# EAGLE design Board Jadwal v2 (EAGLE 6.6.0)
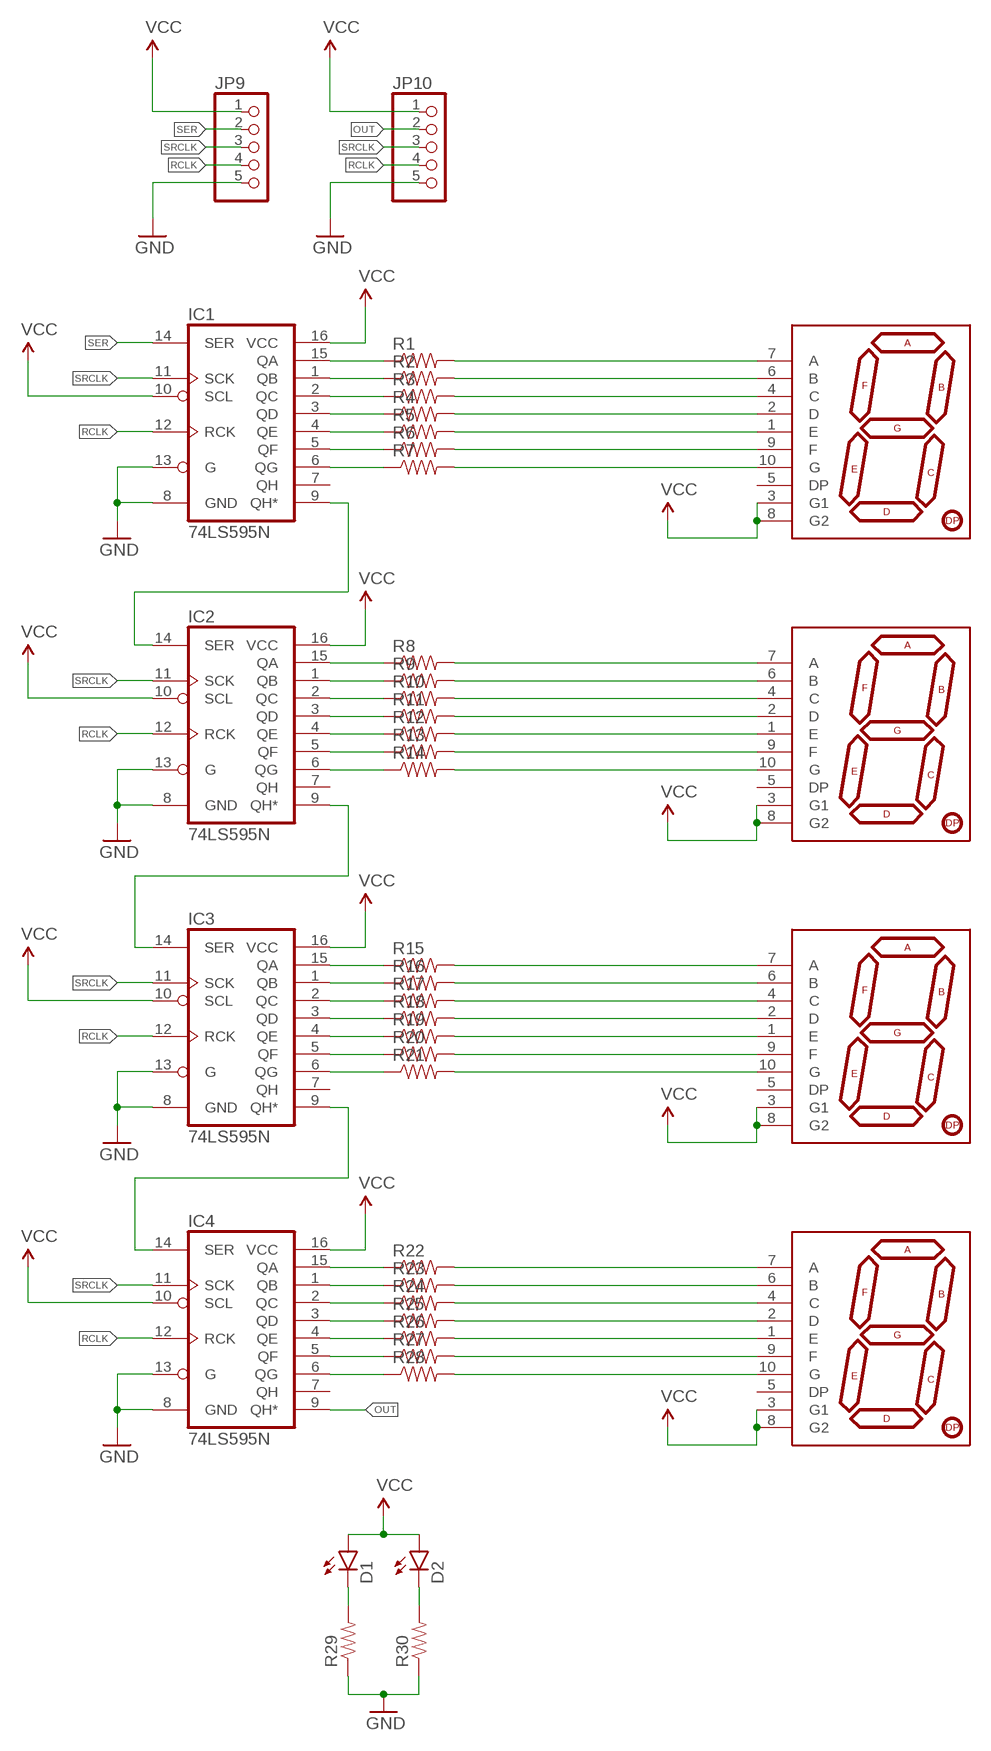
[diagram p0: schematic, sheet 1]

## Parts
D1  LED3MM  [LED3MM]
D2  LED3MM  [LED3MM]
IC1  74LS595N  [DIL16]
IC2  74LS595N  [DIL16]
IC3  74LS595N  [DIL16]
IC4  74LS595N  [DIL16]
JP9  PINHD-1X5  [1X05]
JP10  PINHD-1X5  [1X05]
R1  RESISTORPTH-1/4W  [AXIAL-0.4]
R2  RESISTORPTH-1/4W  [AXIAL-0.4]
R3  RESISTORPTH-1/4W  [AXIAL-0.4]
R4  RESISTORPTH-1/4W  [AXIAL-0.4]
R5  RESISTORPTH-1/4W  [AXIAL-0.4]
R6  RESISTORPTH-1/4W  [AXIAL-0.4]
R7  RESISTORPTH-1/4W  [AXIAL-0.4]
R8  RESISTORPTH-1/4W  [AXIAL-0.4]
R9  RESISTORPTH-1/4W  [AXIAL-0.4]
R10  RESISTORPTH-1/4W  [AXIAL-0.4]
R11  RESISTORPTH-1/4W  [AXIAL-0.4]
R12  RESISTORPTH-1/4W  [AXIAL-0.4]
R13  RESISTORPTH-1/4W  [AXIAL-0.4]
R14  RESISTORPTH-1/4W  [AXIAL-0.4]
R15  RESISTORPTH-1/4W  [AXIAL-0.4]
R16  RESISTORPTH-1/4W  [AXIAL-0.4]
R17  RESISTORPTH-1/4W  [AXIAL-0.4]
R18  RESISTORPTH-1/4W  [AXIAL-0.4]
R19  RESISTORPTH-1/4W  [AXIAL-0.4]
R20  RESISTORPTH-1/4W  [AXIAL-0.4]
R21  RESISTORPTH-1/4W  [AXIAL-0.4]
R22  RESISTORPTH-1/4W  [AXIAL-0.4]
R23  RESISTORPTH-1/4W  [AXIAL-0.4]
R24  RESISTORPTH-1/4W  [AXIAL-0.4]
R25  RESISTORPTH-1/4W  [AXIAL-0.4]
R26  RESISTORPTH-1/4W  [AXIAL-0.4]
R27  RESISTORPTH-1/4W  [AXIAL-0.4]
R28  RESISTORPTH-1/4W  [AXIAL-0.4]
R29  RESISTORPTH-1/4W  [AXIAL-0.4]
R30  RESISTORPTH-1/4W  [AXIAL-0.4]
U$1  7-SEGMENT-DISPLAY-1"-REDEZ  [7-SEGMENT-1"PTH-EZ]
U$2  7-SEGMENT-DISPLAY-1"-REDEZ  [7-SEGMENT-1"PTH-EZ]
U$3  7-SEGMENT-DISPLAY-1"-REDEZ  [7-SEGMENT-1"PTH-EZ]
U$4  7-SEGMENT-DISPLAY-1"-REDEZ  [7-SEGMENT-1"PTH-EZ]

## Nets
A_0: R1.P$2 U$1.7(A)
B_0: R2.P$2 U$1.6(B)
C_0: R3.P$2 U$1.4(C)
D_0: R4.P$2 U$1.2(D)
E_0: R5.P$2 U$1.1(E)
F_0: R6.P$2 U$1.9(F)
G_0: R7.P$2 U$1.10(G)
GND: IC1.8(GND) IC1.13(G) IC2.8(GND) IC2.13(G) IC3.8(GND) IC3.13(G) IC4.8(GND) IC4.13(G) JP9.5 JP10.5 R29.P$1 R30.P$1
N$1: IC1.15(QA) R1.P$1
N$2: IC2.15(QA) R8.P$1
N$3: IC1.1(QB) R2.P$1
N$4: IC1.2(QC) R3.P$1
N$5: IC1.3(QD) R4.P$1
N$6: IC1.4(QE) R5.P$1
N$7: IC1.5(QF) R6.P$1
N$8: IC1.6(QG) R7.P$1
N$9: IC2.1(QB) R9.P$1
N$10: IC2.2(QC) R10.P$1
N$11: IC2.3(QD) R11.P$1
N$12: IC2.4(QE) R12.P$1
N$13: IC2.5(QF) R13.P$1
N$14: IC2.6(QG) R14.P$1
N$15: IC3.15(QA) R15.P$1
N$16: IC3.1(QB) R16.P$1
N$17: IC3.2(QC) R17.P$1
N$18: IC3.3(QD) R18.P$1
N$19: IC3.4(QE) R19.P$1
N$20: IC3.5(QF) R20.P$1
N$21: IC3.6(QG) R21.P$1
N$22: IC4.15(QA) R22.P$1
N$23: IC4.1(QB) R23.P$1
N$24: IC4.2(QC) R24.P$1
N$25: IC4.3(QD) R25.P$1
N$26: IC4.4(QE) R26.P$1
N$27: IC4.5(QF) R27.P$1
N$28: IC4.6(QG) R28.P$1
N$29: IC1.9(QH*) IC2.14(SER)
N$30: IC2.9(QH*) IC3.14(SER)
N$31: IC3.9(QH*) IC4.14(SER)
N$32: D1.K(C) R29.P$2
N$33: D2.K(C) R30.P$2
N$34: R8.P$2 U$2.7(A)
N$35: R9.P$2 U$2.6(B)
N$36: R10.P$2 U$2.4(C)
N$37: R11.P$2 U$2.2(D)
N$38: R12.P$2 U$2.1(E)
N$39: R13.P$2 U$2.9(F)
N$40: R14.P$2 U$2.10(G)
N$41: R15.P$2 U$3.7(A)
N$42: R16.P$2 U$3.6(B)
N$43: R17.P$2 U$3.4(C)
N$44: R18.P$2 U$3.2(D)
N$45: R19.P$2 U$3.1(E)
N$46: R20.P$2 U$3.9(F)
N$47: R21.P$2 U$3.10(G)
N$48: R22.P$2 U$4.7(A)
N$49: R23.P$2 U$4.6(B)
N$50: R24.P$2 U$4.4(C)
N$51: R25.P$2 U$4.2(D)
N$52: R26.P$2 U$4.1(E)
N$53: R27.P$2 U$4.9(F)
N$54: R28.P$2 U$4.10(G)
OUT: IC4.9(QH*) JP10.2
RCLK: IC1.12(RCK) IC2.12(RCK) IC3.12(RCK) IC4.12(RCK) JP9.4 JP10.4
SER: IC1.14(SER) JP9.2
SRCLK: IC1.11(SCK) IC2.11(SCK) IC3.11(SCK) IC4.11(SCK) JP9.3 JP10.3
VCC: D1.A D2.A IC1.10(SCL) IC1.16(VCC) IC2.10(SCL) IC2.16(VCC) IC3.10(SCL) IC3.16(VCC) IC4.10(SCL) IC4.16(VCC) JP9.1 JP10.1 U$1.3(G1) U$1.8(G2) U$2.3(G1) U$2.8(G2) U$3.3(G1) U$3.8(G2) U$4.3(G1) U$4.8(G2)
Unconnected: IC1.7(QH) IC2.7(QH) IC3.7(QH) IC4.7(QH) U$1.5(DP) U$2.5(DP) U$3.5(DP) U$4.5(DP)

## Library data of the parts
D1 D2 = SparkFun-LED:LED: LEDs Standard schematic elements and footprints for 5mm, 3mm, 1206, and 0603 sized LEDs. 5mm - Spark Fun Electronics SKU : COM-00529 (and others)
IC1-IC4 = SparkFun-DigitalIC:74*595: 8-bit SHIFT REGISTER, output latch
JP9 JP10 = pinhead:PINHD-1X5: PIN HEADER
R1-R30 = SparkFun-Passives:RESISTOR: Resistor Basic schematic elements and footprints for 0603, 1206, and PTH resistors.
U$1-U$4 = yogaLibrary:7-SEGMENT-DISPLAY-1"-RED: 7-Segment Display 1" Red (COM-08546) EZ is for kits. Pads are only exposed on the bottom side to help prevent soldering in upside down.

## Board
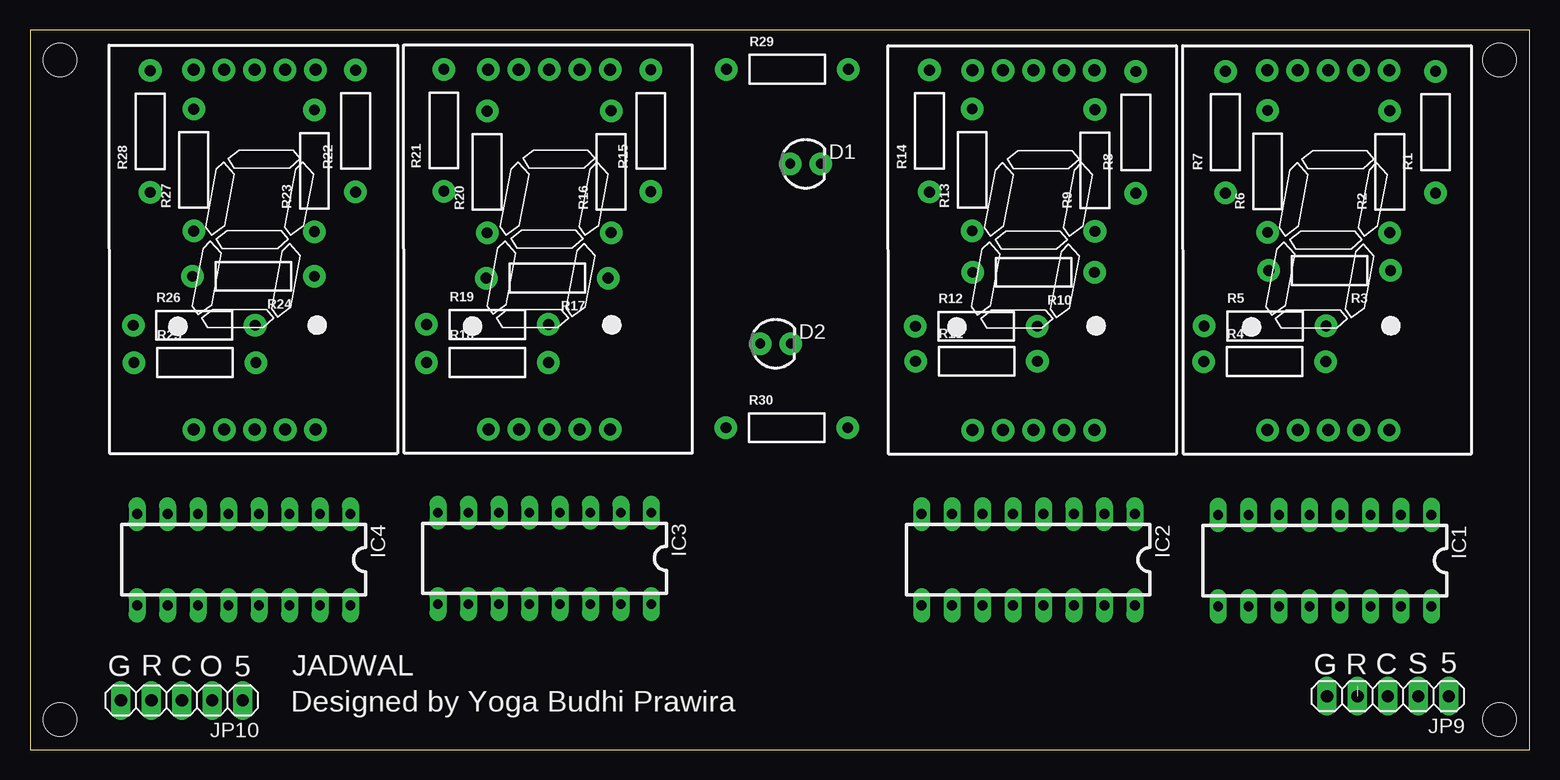
[diagram p1: board, top side]
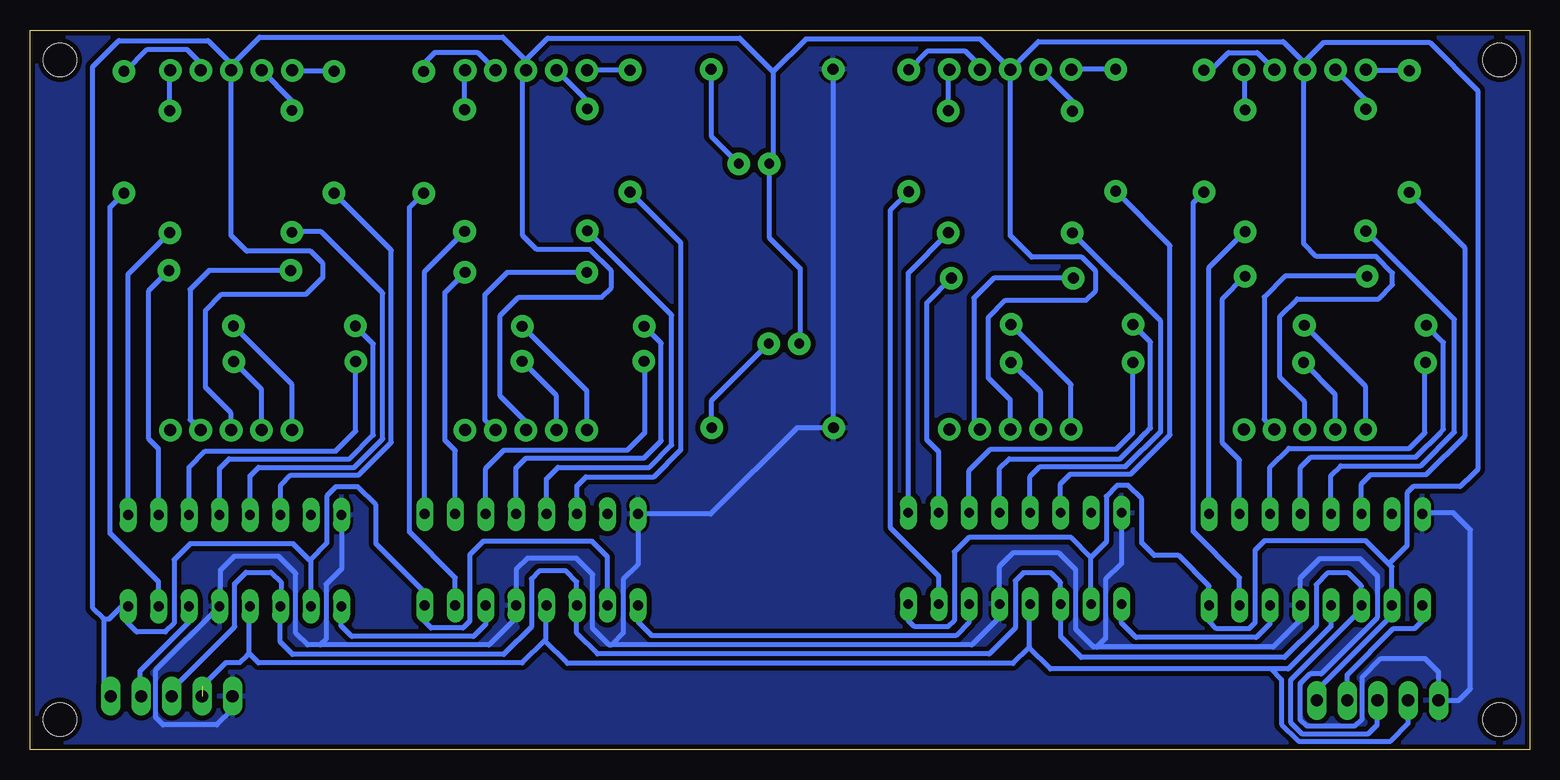
[diagram p2: board, bottom side, seen from below]

Size 125 x 60 mm. Coordinates in mm from the lower left corner, seen from the top.
Outline: 0,0 125,0 125,60 0,60 0,0
Copper layers (1*16): Top 0.035mm / dielectric 1.5mm / Bottom 0.035mm
Design rules "SparkFun": minimum track width 8mil, minimum drill 20mil, track to track 8mil, track to pad 8mil, pad to pad 8mil, via to via 8mil, smd to smd 8mil, copper to edge 8mil, drill to drill 8mil, minimum pad ring 12mil, minimum via ring 10mil, stop-mask expansion 4mil, vias tented up to drill 20mil, thermal gap 10mil
Holes 2.8 mm at 2.5,57.5 2.5,2.5 122.5,57.5 122.5,2.5

### Footprints (pad centres in the part's own frame; a part is rotated, then mirrored left to right if it is on the bottom)
LED3MM = drill 0.813 pad 1.88: A -1.27,0; K 1.27,0
DIL16 = drill 0.813 long: 1 -8.89,-3.81; 2 -6.35,-3.81; 3 -3.81,-3.81; 4 -1.27,-3.81; 5 1.27,-3.81; 6 3.81,-3.81; 7 6.35,-3.81; 8 8.89,-3.81; 9 8.89,3.81; 10 6.35,3.81; 11 3.81,3.81; 12 1.27,3.81; 13 -1.27,3.81; 14 -3.81,3.81; 15 -6.35,3.81; 16 -8.89,3.81
1X05 = drill 1.016 long: 1 -5.08,0; 2 -2.54,0; 3 0,0; 4 2.54,0; 5 5.08,0
AXIAL-0.4 = drill 0.9 pad 1.88: P$1 -5.08,0; P$2 5.08,0
7-SEGMENT-1"PTH-EZ = drill 1 pad 1.88: 1 -4.95,-15.09; 2 -2.41,-15.09; 3 0.13,-15.09; 4 2.67,-15.09; 5 5.21,-15.09; 6 5.2,14.91; 7 2.66,14.91; 8 0.12,14.91; 9 -2.42,14.91; 10 -4.96,14.91

### Placement (x,y rotation side)
D1  64.65,48.85 0 top
D2  62.15,33.85 0 top
IC1  107.93,15.75 180 top
IC2  83.21,15.83 180 top
IC3  42.9,15.94 180 top
IC4  17.82,15.83 180 top
JP9  113.2,4.44 180 top
JP10  12.66,4.1 180 top
R1  117.16,51.48 90 top
R2  113.35,48.18 90 top
R3  108.34,39.94 180 top
R4  102.93,32.35 0 top
R5  102.96,35.32 0 top
R6  103.17,48.21 90 top
R7  99.65,51.48 90 top
R8  92.18,51.47 90 top
R9  88.77,48.28 90 top
R10  83.66,39.79 180 top
R11  78.9,32.38 0 top
R12  78.89,35.3 0 top
R13  78.54,48.33 90 top
R14  74.98,51.57 90 top
R15  51.75,51.6 90 top
R16  48.44,48.18 90 top
R17  43.11,39.31 180 top
R18  38.14,32.27 0 top
R19  38.14,35.44 0 top
R20  38.11,48.16 90 top
R21  34.5,51.64 90 top
R22  27.14,51.57 90 top
R23  23.71,48.26 90 top
R24  18.63,39.46 180 top
R25  13.75,32.26 0 top
R26  13.69,35.38 0 top
R27  13.65,48.32 90 top
R28  10.02,51.53 90 top
R29  63.14,56.72 0 top
R30  63.09,26.83 0 top
U$1  108.1,41.72 0 top
U$2  83.53,41.72 0 top
U$3  43.16,41.79 0 top
U$4  18.6,41.77 0 top

### Tracks (layer width: path | path; a pad name or v marks a point on that pad's centre or on a via)
A_0
  Bottom 0.406: R1.P$2 117.04,56.56 115.21,58.39 111.92,58.39 110.8,57.27 110.8,56.67 U$1.7
B_0
  Bottom 0.406: R2.P$2 113.35,56.58 U$1.6
C_0
  Bottom 0.406: R3.P$2 110.08,39.94 111.65,38.37 111.65,27.51 U$1.4
D_0
  Bottom 0.406: U$1.2 105.69,30.03 R4.P$2
E_0
  Bottom 0.406: U$1.1 103.15,30.43 R5.P$2
F_0
  Bottom 0.406: R6.P$2 103.17,54.12 U$1.9
G_0
  Bottom 0.406: R7.P$2 103.07,56.56 U$1.10
GND
  Bottom 0.406: R29.P$1 58.01,56.67 R30.P$1 61.07,26.83 68.26,19.64 IC2.8 74.32,15.41 75.55,14.18 75.55,9.71 76.54,8.72 | 36.05,8.55 21.37,8.55 19.09,10.83 IC4.13 19.09,14.31 17.48,15.92 14.13,15.92 12.7,14.49 12.7,10.98 17.37,6.31 18.31,6.31 19.14,5.48 19.14,2.51 18.55,1.97 14.58,1.97 13.95,2.55 13.95,6.02 12.38,7.59 8.71,7.59 7.59,6.47 JP10.5 5.9,4.1 4.93,5.07 4.93,18.33 6.35,19.75 8.82,19.75 IC4.8 | 36.05,8.55 36.35,8.55 37.83,10.03 37.83,14.98 39.24,16.39 43.07,16.39 44.17,15.29 IC3.13 44.16,11.06 46.5,8.72 76.54,8.72 | IC3.8 34.01,15.5 35.34,14.17 35.34,9.26 36.05,8.55 | 76.54,8.72 76.72,8.72 78.1,10.1 78.1,14.6 79.45,15.95 83.54,15.95 84.46,15.03 84.46,12.04 | 84.46,12.04 84.46,11 86.75,8.71 100.8,8.71 | 100.8,8.71 101.86,8.71 102.85,9.7 102.85,14.68 104.28,16.11 107.96,16.11 109.13,14.94 109.13,12.01 IC1.13 114.51,6.63 114.51,2.67 113.9,2.06 109.42,2.06 108.12,3.36 JP9.5 | 84.46,12.04 IC2.13 | IC1.8 99.04,15.06 100.32,13.78 100.32,9.19 100.8,8.71
  pour Bottom (isolate 0.406): 0.25,0 arc-90 0,0.25
  pour Bottom (isolate 0.406): 0,60 125,60 125,0 0,0
N$1
  Bottom 0.406: IC1.15 114.28,13.98 118.32,18.02 118.32,45.24 R1.P$1
N$2
  Bottom 0.406: IC2.15 89.56,14.33 93.37,18.14 93.37,45.2 R8.P$1
N$3
  Bottom 0.406: IC1.1 116.82,39.63 R2.P$1
N$4
  Bottom 0.406: IC1.2 114.28,25.08 115.1,25.9 115.1,38.26 R3.P$1
N$5
  Bottom 0.406: IC1.3 111.74,23.53 110.39,24.88 99.51,24.88 97.84,26.55 R4.P$1
N$6
  Bottom 0.406: IC1.4 109.2,23.45 108.41,24.24 98.35,24.24 96.38,26.21 96.38,33.82 R5.P$1
N$7
  Bottom 0.406: IC1.5 106.66,22.82 105.94,23.54 97.96,23.54 95.6,25.9 95.6,38.05 100.73,43.18 103.12,43.18 R6.P$1
N$8
  Bottom 0.406: IC1.6 104.12,22.02 103.26,22.88 97.61,22.88 94.88,25.61 94.88,41.63 R7.P$1
N$9
  Bottom 0.406: IC2.1 92.1,39.87 R9.P$1
N$10
  Bottom 0.406: IC2.2 89.56,24.93 90.41,25.78 90.41,38.12 R10.P$1
N$11
  Bottom 0.406: IC2.3 87.02,23.43 85.48,24.97 75.2,24.97 73.74,26.43 73.74,32.3 R11.P$1
N$12
  Bottom 0.406: IC2.4 84.48,23.48 83.65,24.31 73.82,24.31 72.39,25.74 72.39,33.88 R12.P$1
N$13
  Bottom 0.406: IC2.5 81.94,22.57 80.98,23.53 73.36,23.53 71.51,25.38 71.51,36.22 R13.P$1
N$14
  Bottom 0.406: IC2.6 79.4,22 78.65,22.75 72.99,22.75 70.73,25.01 70.73,42.24 R14.P$1
N$15
  Bottom 0.406: IC3.15 49.25,14.45 53.26,18.46 53.26,45.01 R15.P$1
N$16
  Bottom 0.406: IC3.1 51.79,39.75 R16.P$1
N$17
  Bottom 0.406: IC3.2 49.25,24.83 50.25,25.83 50.25,37.25 R17.P$1
N$18
  Bottom 0.406: IC3.3 46.71,23.26 44.92,25.05 34.45,25.05 33.07,26.43 R18.P$1
N$19
  Bottom 0.406: IC3.4 44.17,23.47 43.39,24.25 34.14,24.25 32.36,26.03 32.36,26.05 32.01,26.4 31.99,26.4 31.59,26.8 31.59,33.97 R19.P$1
N$20
  Bottom 0.406: IC3.5 41.63,22.77 40.81,23.59 33.67,23.59 30.74,26.52 30.74,35.71 R20.P$1
N$21
  Bottom 0.406: IC3.6 39.09,22.16 38.29,22.96 33.25,22.96 29.96,26.25 29.96,42.02 R21.P$1
N$22
  Bottom 0.406: R22.P$1 28.03,45.6 28.03,18.18 24.17,14.32 IC4.15
N$23
  Bottom 0.406: IC4.1 26.71,40.18 R23.P$1
N$24
  Bottom 0.406: IC4.2 24.17,24.14 25.6,25.57 25.6,37.57 R24.P$1
N$25
  Bottom 0.406: IC4.3 21.63,23.56 20.08,25.11 10.01,25.11 8.72,26.4 8.72,32.21 R25.P$1
N$26
  Bottom 0.406: IC4.4 19.09,23.52 18.22,24.39 9.48,24.39 7.37,26.5 7.37,26.52 7.17,26.72 7.17,33.94 R26.P$1
N$27
  Bottom 0.406: IC4.5 16.55,22.86 15.75,23.66 9.08,23.66 6.27,26.47 6.27,35.86 R27.P$1
N$28
  Bottom 0.406: IC4.6 14.01,22.14 13.23,22.92 8.61,22.92 5.37,26.16 5.37,41.8 R28.P$1
N$29
  Bottom 0.406: IC2.14 87.02,10.44 88.04,9.42 98.17,9.42 99.08,10.33 99.08,11.9 IC1.9
N$30
  Bottom 0.406: IC3.14 46.71,10.61 47.82,9.5 73.16,9.5 74.31,10.65 IC2.9
N$31
  Bottom 0.406: IC4.14 21.63,10.5 22.79,9.34 32.81,9.34 34.02,10.55 IC3.9
N$32
  Bottom 0.406: R29.P$2 68.22,51.15 D1.K
N$33
  Bottom 0.406: R30.P$2 68.17,29.1 D2.K
N$34
  Bottom 0.406: R8.P$2 92.18,57.2 91.24,58.14 87.7,58.14 U$2.7
N$35
  Bottom 0.406: R9.P$2 88.77,56.59 U$2.6
N$36
  Bottom 0.406: R10.P$2 85.21,39.79 87.09,37.91 87.09,27.52 U$2.4
N$37
  Bottom 0.406: U$2.2 81.12,29.52 R11.P$2
N$38
  Bottom 0.406: U$2.1 78.58,29.91 R12.P$2
N$39
  Bottom 0.406: R13.P$2 78.54,54.06 U$2.9
N$40
  Bottom 0.406: R14.P$2 78.55,56.65 U$2.10
N$41
  Bottom 0.406: U$3.7 45.82,57.01 47.02,58.21 50.22,58.21 R15.P$2
N$42
  Bottom 0.406: R16.P$2 48.44,56.62 U$3.6
N$43
  Bottom 0.406: R17.P$2 44.66,39.31 46.32,37.65 46.32,27.19 U$3.4
N$44
  Bottom 0.406: U$3.2 40.75,29.8 R18.P$2
N$45
  Bottom 0.406: U$3.1 38.21,30.43 R19.P$2
N$46
  Bottom 0.406: R20.P$2 38.11,54.07 U$3.9
N$47
  Bottom 0.406: R21.P$2 38.18,56.72 U$3.10
N$48
  Bottom 0.406: R22.P$2 26.56,56.65 25.09,58.12 22.7,58.12 U$4.7
N$49
  Bottom 0.406: R23.P$2 23.71,56.59 U$4.6
N$50
  Bottom 0.406: R24.P$2 20.39,39.46 22.12,37.73 22.12,27.53 U$4.4
N$51
  Bottom 0.406: U$4.2 16.19,29.62 R25.P$2
N$52
  Bottom 0.406: U$4.1 13.65,30.26 R26.P$2
N$53
  Bottom 0.406: R27.P$2 13.65,54.15 U$4.9
N$54
  Bottom 0.406: R28.P$2 13.57,56.61 U$4.10
OUT
  Bottom 0.406: IC4.9 8.93,11.31 8.95,11.29 8.95,10.72 9.58,10.09 11.34,10.09 15.2,6.23 JP10.2
RCLK  (1 unrouted)
  Bottom 0.406: IC4.12 16.55,10.27 20.11,6.71 21.54,6.71 | 21.54,6.71 39.94,6.71 41.73,8.5 | IC3.12 41.67,12.09 41.67,8.56 41.73,8.5 | 41.73,8.5 43.05,7.18 80.19,7.18 82.09,9.08 | IC2.12 81.98,11.98 81.98,9.19 82.09,9.08 | 82.09,9.08 83.96,7.21 105.95,7.21 106.75,8.01 | 106.63,11.91 IC1.12 106.75,11.85 106.75,8.01 | 110.66,5.26 108.66,7.26 107.51,7.26 106.91,7.86 106.9,7.86 106.75,8.01 | JP10.4 10.11,2.17 11.58,0.7 19.26,0.7 19.36,0.8 19.37,0.8 20.68,2.11 20.68,5.85 21.54,6.71
SER
  Bottom 0.406: IC1.14 111.78,11.9 111.78,10.53 111.86,10.53 115.85,6.54 115.85,4.55 JP9.2
SRCLK
  Bottom 0.406: 79.42,12 79.42,9.69 77.69,7.96 45.04,7.96 42.86,10.14 42.86,14.07 42.19,14.74 39.91,14.74 39.09,13.92 IC3.11 39.07,12.11 39.07,9.38 37.36,7.67 20.43,7.67 17.78,10.32 17.78,13.77 16.84,14.71 15.09,14.71 14.01,13.63 IC4.11 14.01,11.7 19.92,5.79 19.92,2.28 18.96,1.32 13.43,1.32 12.69,2.06 12.69,3.04 12.66,3.07 JP10.3 | 79.42,12 IC2.11 | 79.42,12 79.42,13.99 80.31,14.88 82.55,14.88 83.2,14.23 83.2,10.25 85.52,7.93 103.11,7.93 104.14,8.96 104.14,11.92 IC1.11 104.07,11.99 104.07,13.96 104.9,14.79 106.99,14.79 107.95,13.83 107.91,13.79 107.93,13.77 107.93,10.23 112.86,5.3 113.2,5.3 JP9.3
VCC
  Bottom 0.406: U$4.3 18.73,28.96 20.81,31.04 20.81,36.14 19.37,37.58 12.57,37.58 11.42,38.73 11.42,39.75 12.79,41.12 17.76,41.12 18.83,42.19 18.83,56.57 U$4.8 18.8,56.76 18.8,57.3 | U$3.3 43.29,29.15 45.12,30.98 45.12,36.01 43.67,37.46 36.97,37.46 36.15,38.28 36.15,39.89 37.32,41.06 41.5,41.06 43.29,42.85 U$3.8 | D2.A 60.8,33.93 60.8,40.12 63.38,42.7 D1.A 63.05,49.18 63.05,56.52 | U$2.3 83.66,27.33 85.81,29.48 85.81,36.17 84.26,37.72 77.35,37.72 76.54,38.53 76.54,39.88 78.35,41.69 82.76,41.69 82.76,41.7 83.92,42.86 83.92,56.36 U$2.8 83.68,56.6 83.68,57.48 | U$1.3 108.23,28.05 110.37,30.19 110.37,36.61 109.02,37.96 101.99,37.96 100.57,39.38 100.57,40.51 101.61,41.55 106.92,41.55 108.24,42.87 108.24,56.61 | U$3.8 43.29,56.74 45.79,59.24 60.33,59.24 63.05,56.52 | 83.68,57.48 81.84,59.32 65.85,59.32 63.05,56.52 | 108.24,56.61 108.24,57.03 108.16,57.12 | 108.16,57.12 105.87,59.4 85.6,59.4 83.68,57.48 | 108.24,56.61 U$1.8 | U$3.8 40.95,59.03 20.53,59.03 18.8,57.3 | 11.71,15.48 11.47,15.24 IC4.10 11.48,11.2 17.74,4.94 JP10.1 | 11.71,15.48 13.64,17.41 22.1,17.41 22.89,16.62 22.89,10.58 23.39,10.08 26.09,10.08 26.7,10.69 IC4.16 26.71,13.64 29.25,16.18 31.29,16.18 32.32,17.21 32.32,20.88 33.47,22.03 34.38,22.03 35.29,21.12 35.29,17.3 36.55,16.04 | IC3.10 36.55,16.04 | 36.55,16.04 38.19,17.68 46.74,17.68 47.94,16.48 47.94,10.75 48.46,10.23 51.26,10.23 51.8,10.77 IC3.16 | 11.71,15.48 10.21,16.98 10.21,21.39 9.67,21.93 5.79,21.93 5.27,22.45 5.22,22.45 4.32,23.35 4.32,54.95 8.33,58.96 17.14,58.96 18.8,57.3 | IC2.10 76.86,16.08 78.15,17.37 87.21,17.37 88.34,16.24 88.34,10.7 88.9,10.14 91.58,10.14 92.11,10.67 IC2.16
  Bottom 0.406: IC2.16 | IC1.10 101.58,15.67 101.7,15.79 | 101.7,15.79 103.06,17.15 111.66,17.15 112.99,15.82 112.99,10.53 113.72,9.8 116.09,9.8 116.9,10.61 116.9,11.86 IC1.16 116.84,11.92 117.37,11.92 118.4,10.89 118.86,10.89 | 118.86,10.89 118.86,5.02 JP9.1 | IC2.16 92.11,13.12 96.15,17.16 96.15,20.38 97.67,21.9 99.51,21.9 100.27,21.14 100.27,17.22 101.7,15.79 | 118.86,10.89 119.76,11.79 119.76,56.95 117.6,59.11 110.15,59.11 108.16,57.12

### Text on the board
tNames: G | R | C | O | 5 | JADWAL | G | R | C | S | 5 | Designed by Yoga Budhi Prawira